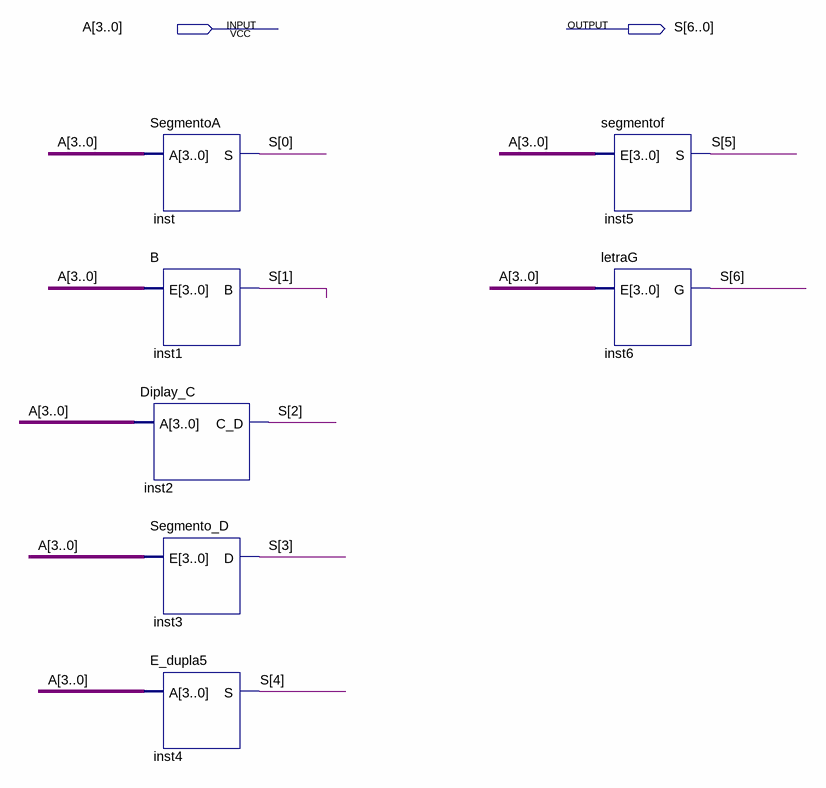
[diagram p0: schematic sheet]
// Quartus schematic BCD.bdf as structural Verilog: 7 symbols, 2 pins
module BCD (
  input  [3:0] A,
  output [6:0] S
);

  SegmentoA inst (.A(A), .S(S[0]));
  B inst1 (.E(A), .B(S[1]));
  Diplay_C inst2 (.A(A), .C_D(S[2]));
  Segmento_D inst3 (.E(A), .D(S[3]));
  E_dupla5 inst4 (.A(A), .S(S[4]));
  segmentof inst5 (.E(A), .S(S[5]));
  letraG inst6 (.E(A), .G(S[6]));
endmodule
